# EasyEDA Pro project PRJ_Feeder_V01c.epro, board Photo
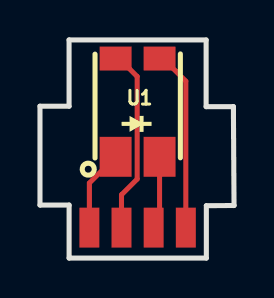
[diagram p15: board, top side]
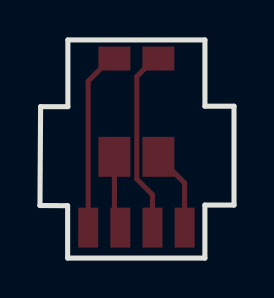
[diagram p16: board, bottom side, seen from below]

Outline 9.71 x 10.92 mm; copper layers: Top Layer, Bottom Layer. Coordinates in mm from the lower left corner of the outline.
Outline path: 0,7.6 0,2.65 1.46,2.65 1.46,0 8.32,0 8.32,2.62 9.71,2.63 9.68,7.58 8.31,7.58 8.31,10.92 1.46,10.92 1.46,7.6 0,7.6
Stack: Top Layer 0.035mm / Dielectric1 1.51mm FR4 er 4.5 / Bottom Layer 0.035mm

## Design rules (mm)
template: JLCPCB Capability(Two Layers Board)
spacing copperThickness1oz (default): track to track 0.102, other pairs 0.152 to 0.3
spacing copperThickness2oz: track to track 0.203, other pairs 0.152 to 0.3
track width copperThickness1oz (default): min 0.127, default 0.254, max 2.54
track width copperThickness2oz: min 0.203, default 0.254, max 2.54
differential pair differentialPair (default): width min 0.127, default 0.254, max 2.54; gap min 0.152, default 0.152
via viaSize (default): diameter min 0.5, default 0.61, max 10; hole min 0.3, default 0.305, max 6.3

## Placement (name value [footprint] x y rotation side)
NOREF  -  [Pad_e2]  2.47 1.52 0 top
NOREF#2  -  [Pad_e7]  4.08 1.52 0 top
NOREF#3  -  [Pad_e8]  7.3 1.52 0 top
NOREF#4  -  [Pad_e3]  5.69 1.52 0 top
U1  EE-SX1320  [OPTO-SMD-4_EE-SX1320]  4.88 7.62 0 top

## Footprints (pads in the part's own frame, mm; a bottom-side part is the same pattern mirrored in y, then rotated)
OPTO-SMD-4_EE-SX1320
  rect 1.6x2 smd: 1(-1.1,-2.55) 2(1.1,-2.55)
  rect 1.6x1.2 smd: 3(1.1,2.37) 4(-1.1,2.37)
Pad_e2
  rect 1x2 smd: (0,0)
Pad_e3
  rect 1x2 smd: (0,0)
Pad_e7
  rect 1x2 smd: (0,0)
Pad_e8
  rect 1x2 smd: (0,0)

## Nets
GND: NOREF#4. U1.2
C: NOREF#2. U1.4
E: NOREF#3. U1.3
LED+: NOREF. U1.1

## Routing (per net, layer and track width the routed paths; a pad name or vN(x,y) marks a point on that pad's centre or on a via; arc(x,y) is an arc through that point)
GND: length 3.4
  Top Layer w0.254: U1.2 5.98,2.07 5.69,1.78
C: length 9.2
  Top Layer w0.254: 3.78,10.17 4.86,9.09 4.86,3.95 4.08,3.17 4.08,1.78
E: length 8.9
  Top Layer w0.254: 5.98,10.17 7.3,8.86 7.3,1.78
LED+: length 3.8
  Top Layer w0.254: 2.47,1.78 2.47,3.76 U1.1
